# Altium schematic sheet Isolation.SchDoc
size A4
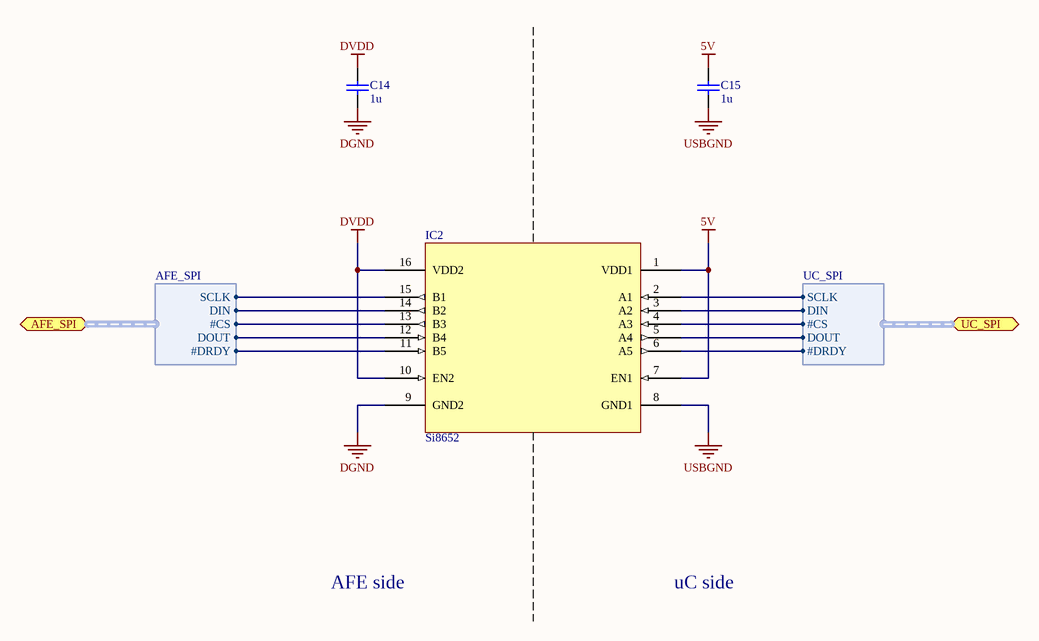
[diagram p0: Isolation.SchDoc]

## Parts
C14  1u  [0805 CAP]
C15  1u  [0805 CAP]
IC2  Si8652  [SOIC127P600X175-16N]

## Ports
AFE_SPI (harness AFE_SPI), UC_SPI (harness UC_SPI)

## Harnesses
AFE_SPI: #CS, #DRDY, DIN, DOUT, SCLK
UC_SPI: SCLK, DIN, #CS, DOUT, #DRDY

## Nets
5V: C15.2 IC2.1(VDD1) IC2.7(EN1)
DGND: C14.1 IC2.9(GND2)
DVDD: C14.2 IC2.10(EN2) IC2.16(VDD2)
USBGND: C15.1 IC2.8(GND1)
NetIC2_2: IC2.2(A1) ; port UC_SPI.SCLK
NetIC2_3: IC2.3(A2) ; port UC_SPI.DIN
NetIC2_4: IC2.4(A3) ; port UC_SPI.#CS
NetIC2_5: IC2.5(A4) ; port UC_SPI.DOUT
NetIC2_6: IC2.6(A5) ; port UC_SPI.#DRDY
NetIC2_11: IC2.11(B5) ; port AFE_SPI.#DRDY
NetIC2_12: IC2.12(B4) ; port AFE_SPI.DOUT
NetIC2_13: IC2.13(B3) ; port AFE_SPI.#CS
NetIC2_14: IC2.14(B2) ; port AFE_SPI.DIN
NetIC2_15: IC2.15(B1) ; port AFE_SPI.SCLK

## Notes on the sheet
- AFE side
- uC side

## Library data of the parts
C14 C15 = Cap: Value: 1u